# Altium schematic sheet INTRODUCTION.SchDoc
size A4; SheetNumber: 1; SheetTotal: 4
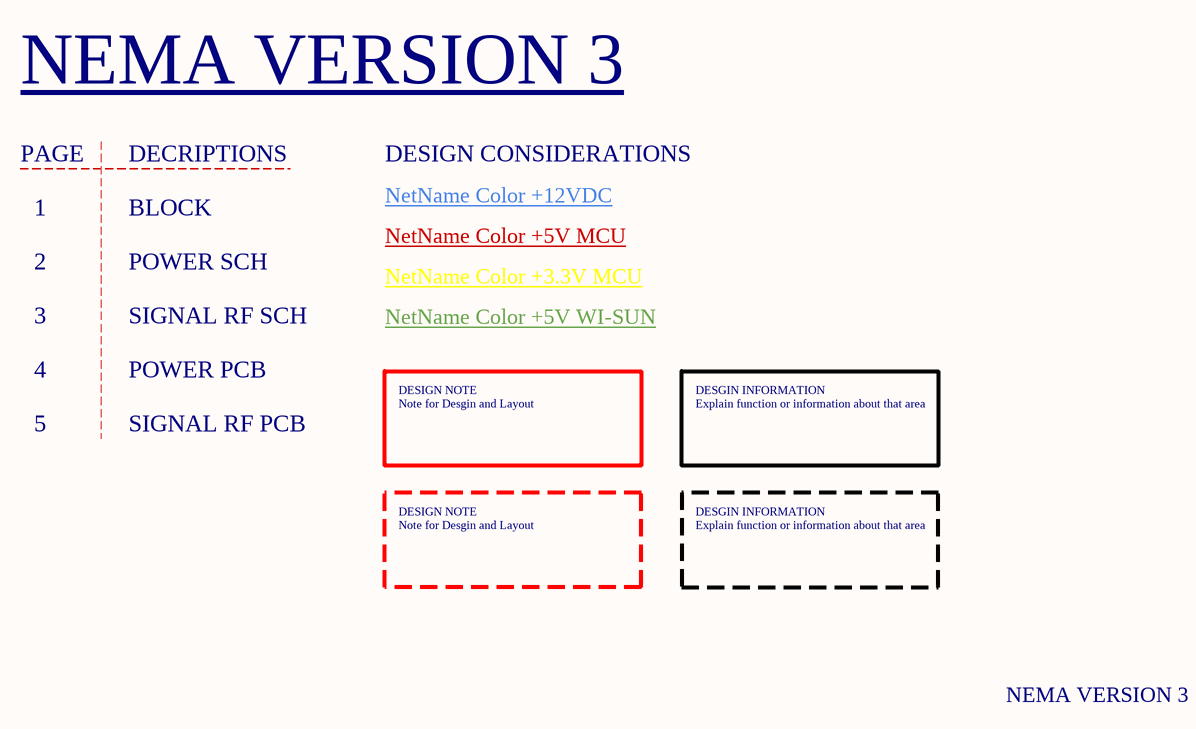
[diagram p0: INTRODUCTION.SchDoc]

## Notes on the sheet
- NEMA VERSION 3
- PAGE
- DECRIPTIONS
- DESIGN CONSIDERATIONS
- 1
- BLOCK
- NetName Color +12VDC
- NetName Color +5V MCU
- 2
- 3
- POWER SCH
- SIGNAL RF SCH
- NetName Color +3.3V MCU
- NetName Color +5V WI-SUN
- 4
- POWER PCB
- DESIGN NOTE
- DESGIN INFORMATION
- 5
- SIGNAL RF PCB
- Note for Desgin and Layout
- Explain function or information about that area
- Mã số:
- Ngày hiệu lực:
- 27.02.2023
- VS-RD-QT-BM-01-04
- Lần ban hành:
- 04
- Lần
- Nội dung thay đổi
- Ngày
- Khối lượng:
- Sheet:
- Tên bản vẽ:
- Vật liệu:
- Thiết kế
- Kiểm tra
- Số lượng:
- Phê duyệt
- Mã LK bản vẽ:
- Tên sản phẩm:
- Đơn vị
- Mã sản phẩm:
- Phiên bản
- Tỷ lệ
- Trang
- MINH REUS